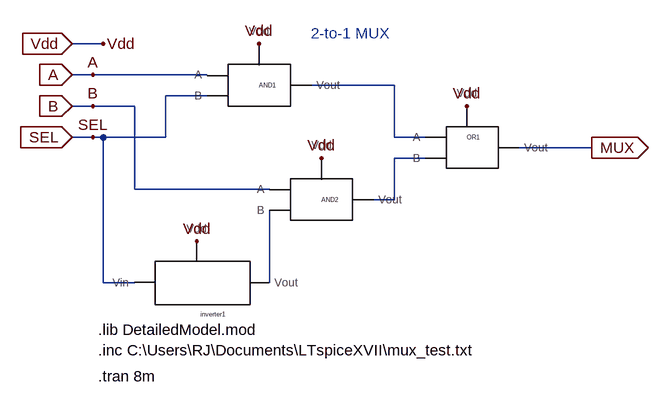
[diagram p0: schematic mux2t1.asc]
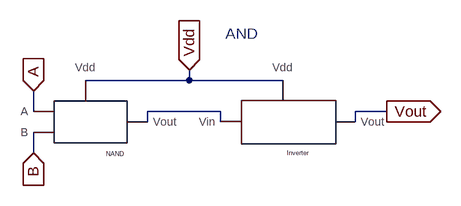
[diagram p1: sub-circuit my_and.asc]
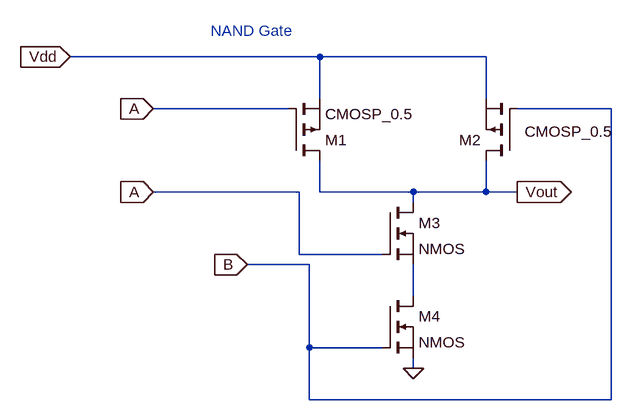
[diagram p2: sub-circuit my_nand.asc]
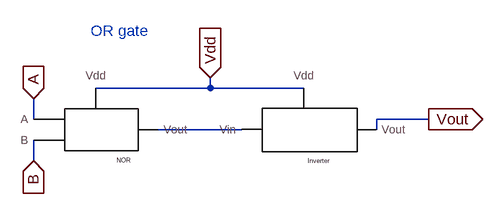
[diagram p3: sub-circuit my_or.asc]
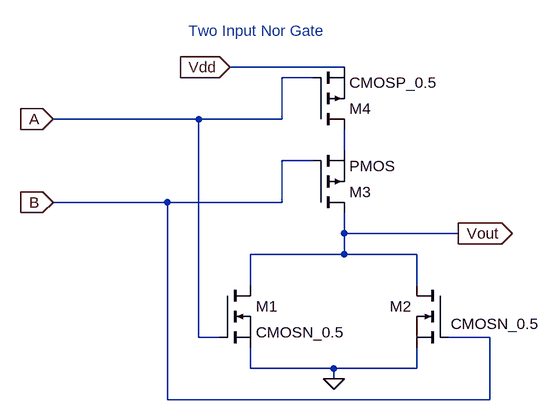
[diagram p4: sub-circuit my_nor.asc]
mux2t1.asc, the LTspice schematic file:
Version 4
SHEET 1 928 680
WIRE 64 48 16 48
WIRE 48 96 16 96
WIRE 224 96 48 96
WIRE 512 112 384 112
WIRE 224 128 160 128
WIRE 48 144 16 144
WIRE 112 144 48 144
WIRE 48 192 16 192
WIRE 64 192 48 192
WIRE 160 192 160 128
WIRE 160 192 64 192
WIRE 512 192 512 112
WIRE 560 192 512 192
WIRE 816 208 704 208
WIRE 560 224 512 224
WIRE 112 272 112 144
WIRE 320 272 112 272
WIRE 512 288 512 224
WIRE 512 288 480 288
WIRE 64 416 64 192
WIRE 112 416 64 416
WIRE 320 416 320 304
FLAG 16 96 A
IOPIN 16 96 In
FLAG 48 96 A
FLAG 16 144 B
IOPIN 16 144 In
FLAG 48 144 B
FLAG 16 192 SEL
IOPIN 16 192 In
FLAG 48 192 SEL
FLAG 816 208 MUX
IOPIN 816 208 Out
FLAG 304 48 Vdd
FLAG 208 352 Vdd
FLAG 400 224 Vdd
FLAG 624 144 Vdd
FLAG 16 48 Vdd
IOPIN 16 48 In
FLAG 64 48 Vdd
SYMBOL my_and 304 112 R0
WINDOW 0 0 0 Left 0
SYMATTR InstName AND1
SYMBOL my_and 400 288 R0
WINDOW 0 0 0 Left 0
SYMATTR InstName AND2
SYMBOL my_inverter 208 416 R0
SYMATTR InstName inverter1
SYMBOL my_or 624 192 R0
WINDOW 0 0 0 Left 0
SYMATTR InstName OR1
TEXT 384 32 Left 2 ;2-to-1 MUX
TEXT 56 488 Left 2 !.lib DetailedModel.mod
TEXT 56 520 Left 2 !.inc C:\\Users\\RJ\\Documents\\LTspiceXVII\\mux_test.txt
TEXT 56 560 Left 2 !.tran 8m

my_and.asc, the sub-circuit schematic file:
Version 4
SHEET 1 880 680
WIRE 288 112 288 96
WIRE 288 112 128 112
WIRE 432 112 288 112
WIRE 48 160 48 128
WIRE 336 160 224 160
WIRE 592 160 544 160
WIRE 224 176 224 160
WIRE 336 176 336 160
WIRE 544 176 544 160
WIRE 48 224 48 192
FLAG 48 128 A
IOPIN 48 128 In
FLAG 48 224 B
IOPIN 48 224 In
FLAG 288 96 Vdd
IOPIN 288 96 In
FLAG 592 160 Vout
IOPIN 592 160 Out
SYMBOL my_nand 128 176 R0
SYMATTR InstName NAND
SYMBOL my_inverter 432 176 R0
SYMATTR InstName Inverter
TEXT 344 40 Left 2 ;AND

my_nand.asc, the sub-circuit schematic file:
Version 4
SHEET 1 932 680
WIRE 480 -16 96 -16
WIRE 736 -16 480 -16
WIRE 480 48 480 -16
WIRE 736 48 736 -16
WIRE 432 64 224 64
WIRE 928 64 784 64
WIRE 448 192 224 192
WIRE 480 192 480 144
WIRE 624 192 480 192
WIRE 736 192 736 144
WIRE 736 192 624 192
WIRE 784 192 736 192
WIRE 624 208 624 192
WIRE 448 288 448 192
WIRE 576 288 448 288
WIRE 464 304 368 304
WIRE 624 352 624 304
WIRE 464 432 464 304
WIRE 576 432 464 432
WIRE 624 464 624 448
WIRE 464 512 464 432
WIRE 928 512 928 64
WIRE 928 512 464 512
FLAG 624 464 0
FLAG 96 -16 Vdd
IOPIN 96 -16 In
FLAG 224 64 A
IOPIN 224 64 In
FLAG 224 192 A
IOPIN 224 192 In
FLAG 368 304 B
IOPIN 368 304 In
FLAG 784 192 Vout
IOPIN 784 192 Out
SYMBOL pmos 432 144 M180
SYMATTR InstName M1
SYMATTR Value CMOSP_0.5
SYMBOL pmos 784 144 R180
WINDOW 3 -11 45 Right 2
SYMATTR Value CMOSP_0.5
SYMATTR InstName M2
SYMBOL nmos 576 208 R0
SYMATTR InstName M3
SYMBOL nmos 576 352 R0
SYMATTR InstName M4
TEXT 312 -56 Left 2 ;NAND Gate

my_or.asc, the sub-circuit schematic file:
Version 4
SHEET 1 880 680
WIRE 288 144 288 128
WIRE 288 144 112 144
WIRE 432 144 288 144
WIRE 16 192 16 160
WIRE 624 192 544 192
WIRE 336 208 208 208
WIRE 544 208 544 192
WIRE 16 256 16 224
FLAG 16 160 A
IOPIN 16 160 In
FLAG 16 256 B
IOPIN 16 256 In
FLAG 288 128 Vdd
IOPIN 288 128 In
FLAG 624 192 Vout
IOPIN 624 192 Out
SYMBOL my_nor 112 208 R0
SYMATTR InstName NOR
SYMBOL my_inverter 432 208 R0
SYMATTR InstName Inverter
TEXT 104 56 Left 2 ;OR gate

my_nor.asc, the sub-circuit schematic file:
Version 4
SHEET 1 880 680
WIRE 336 -240 160 -240
WIRE 288 -224 240 -224
WIRE 112 -160 -112 -160
WIRE 240 -160 240 -224
WIRE 240 -160 112 -160
WIRE 336 -112 336 -144
WIRE 288 -96 240 -96
WIRE 64 -32 -112 -32
WIRE 240 -32 240 -96
WIRE 240 -32 64 -32
WIRE 336 16 336 -16
WIRE 512 16 336 16
WIRE 336 48 336 16
WIRE 336 48 192 48
WIRE 448 48 336 48
WIRE 192 96 192 48
WIRE 448 96 448 48
WIRE 112 176 112 -160
WIRE 144 176 112 176
WIRE 560 176 496 176
WIRE 192 224 192 192
WIRE 320 224 192 224
WIRE 448 224 448 192
WIRE 448 224 320 224
WIRE 320 240 320 224
WIRE 64 272 64 -32
WIRE 560 272 560 176
WIRE 560 272 64 272
FLAG -112 -32 B
IOPIN -112 -32 In
FLAG -112 -160 A
IOPIN -112 -160 In
FLAG 160 -240 Vdd
IOPIN 160 -240 In
FLAG 512 16 Vout
IOPIN 512 16 Out
FLAG 320 240 0
SYMBOL nmos 144 96 R0
SYMATTR InstName M1
SYMATTR Value CMOSN_0.5
SYMBOL nmos 496 96 M0
WINDOW 3 -141 59 Left 2
SYMATTR Value CMOSN_0.5
SYMATTR InstName M2
SYMBOL pmos 288 -144 M180
SYMATTR InstName M4
SYMATTR Value CMOSP_0.5
SYMBOL pmos 288 -16 M180
SYMATTR InstName M3
TEXT 96 -296 Left 2 ;Two Input Nor Gate

The netlist it stands for:
* mux2t1.asc
XAND1 A SEL N001 Vdd my_and
XAND2 B N003 N002 Vdd my_and
Xinverter1 SEL Vdd N003 my_inverter  ; pins Vin Vdd Vout
XOR1 N001 N002 Vdd MUX my_or

* block symbol definitions
.subckt my_and A B Vout Vdd
XNAND A B N001 Vdd my_nand
XInverter N001 Vdd Vout my_inverter  ; pins Vin Vdd Vout
* AND
.ends my_and

.subckt my_nand A B Vout Vdd
M1 Vout A Vdd Vdd CMOSP_0.5
M2 Vout B Vdd Vdd CMOSP_0.5
M3 Vout A N001 N001 NMOS
M4 N001 B 0 0 NMOS
* NAND Gate
.ends my_nand

.subckt my_or A B Vdd Vout
XNOR A B N001 Vdd my_nor
XInverter N001 Vdd Vout my_inverter  ; pins Vin Vdd Vout
* OR gate
.ends my_or

.subckt my_nor A B Vout Vdd
M1 Vout A 0 0 CMOSN_0.5
M2 Vout B 0 0 CMOSN_0.5
M4 N001 A Vdd Vdd CMOSP_0.5
M3 Vout B N001 N001 PMOS
* Two Input Nor Gate
.ends my_nor

.model NMOS NMOS
.model PMOS PMOS
.lib standard.mos
* 2-to-1 MUX
.lib DetailedModel.mod
.inc C:\Users\RJ\Documents\LTspiceXVII\mux_test.txt
.tran 8m
.backanno
.end